# EAGLE design HopeToPass-BASIC (EAGLE 9.6.2)
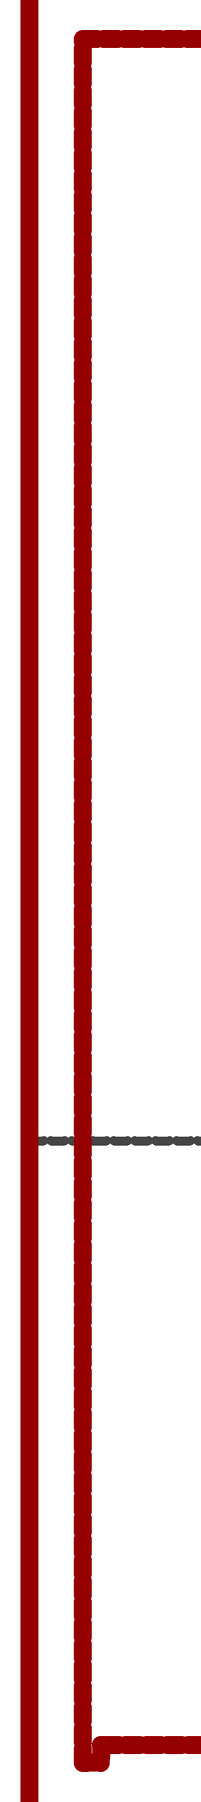
[diagram p0: schematic, sheet 1, part 1 of 2]
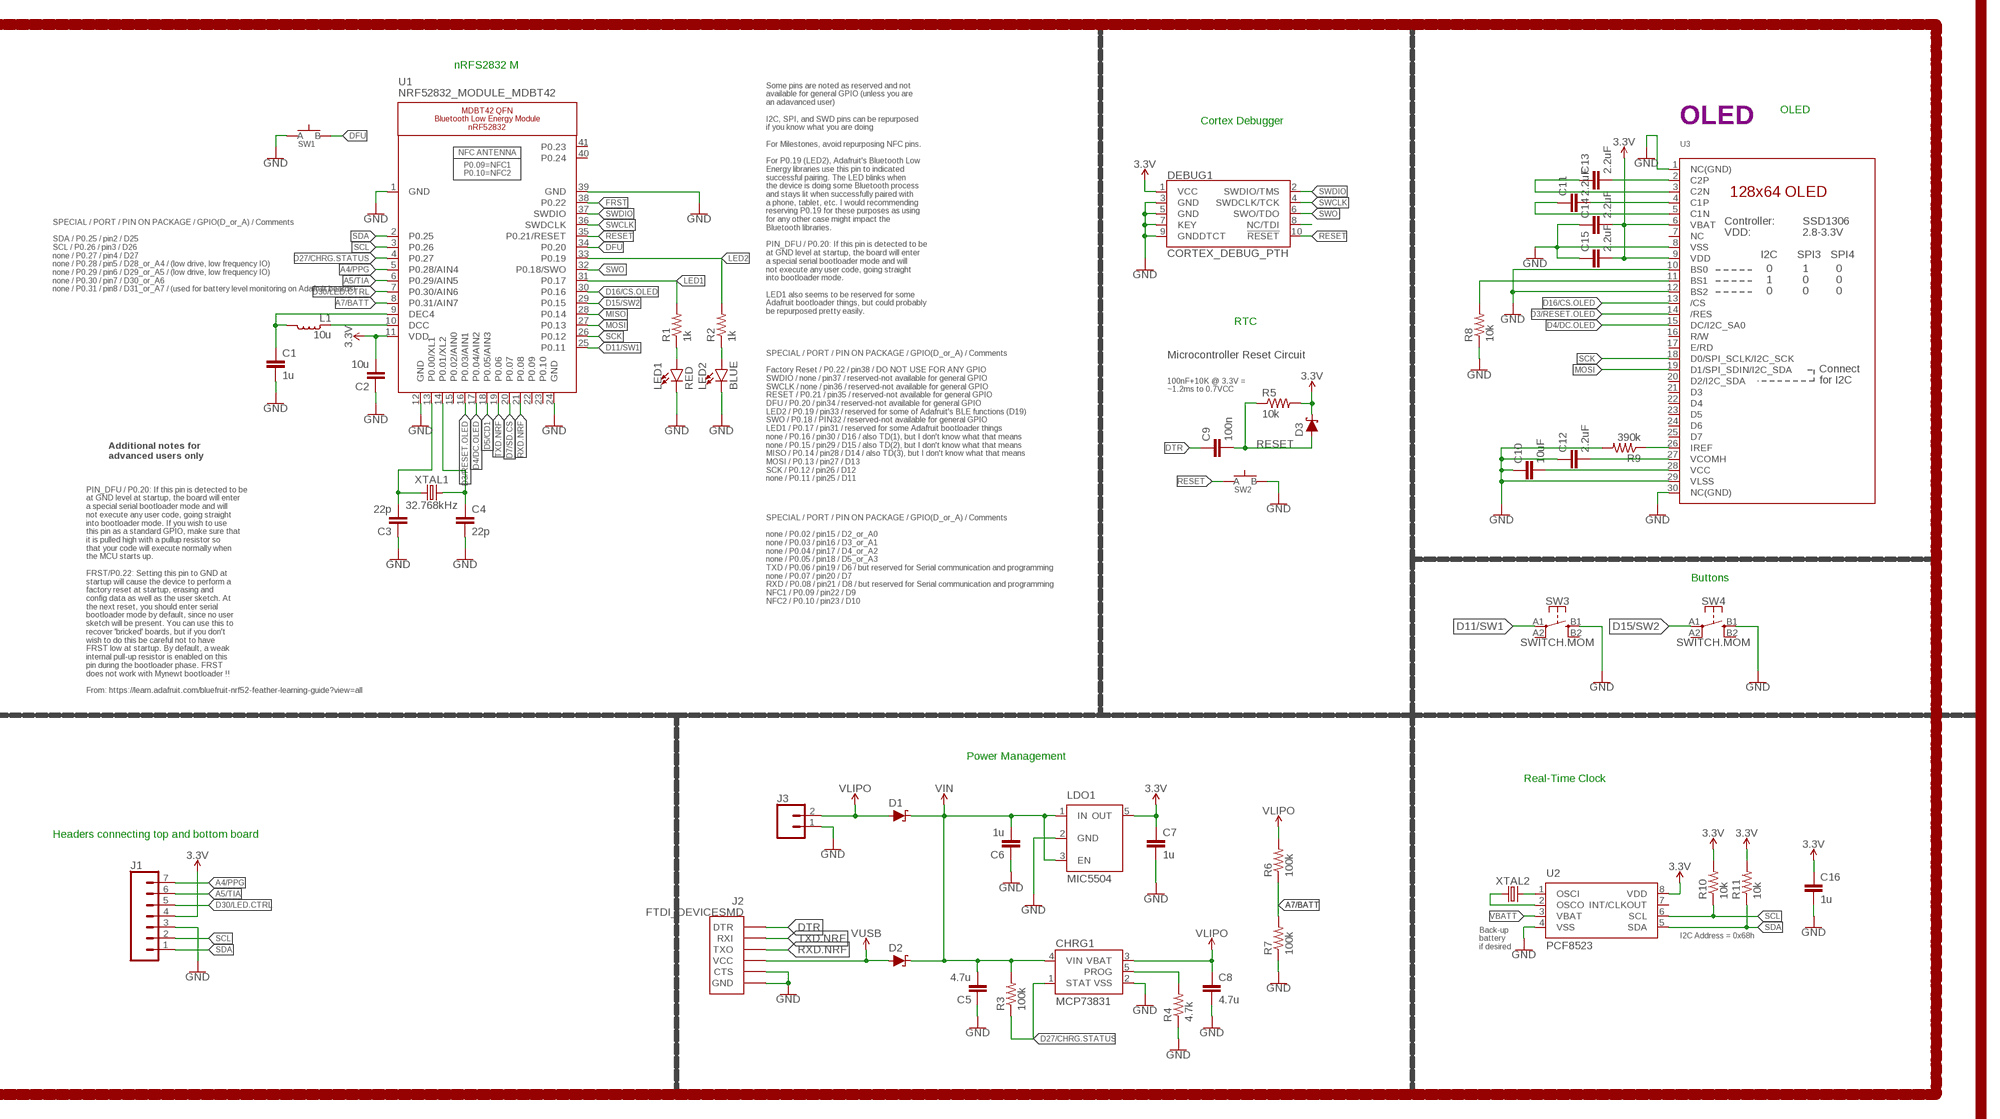
[diagram p1: schematic, sheet 1, part 2 of 2]

## Parts
C1  1u  CAPACITOR0603  [C0603]
C2  10u  CAPACITOR0805  [C0805]
C3  22p  CAPACITOR0603  [C0603]
C4  22p  CAPACITOR0603  [C0603]
C5  4.7u  CAPACITOR0603  [C0603]
C6  1u  CAPACITOR0603  [C0603]
C7  1u  CAPACITOR0603  [C0603]
C8  4.7u  CAPACITOR0603  [C0603]
C9  100n  CAPACITOR0603  [C0603]
C10  10uF  CAPACITOR0603  [C0603]
C11  2.2uF  CAPACITOR0603  [C0603]
C12  2.2uF  CAPACITOR0603  [C0603]
C13  2.2uF  CAPACITOR0603  [C0603]
C14  2.2uF  CAPACITOR0603  [C0603]
C15  2.2uF  CAPACITOR0603  [C0603]
C16  1u  CAPACITOR0603  [C0603]
CHRG1  MCP73831  [SOT23-5]
D1  SCHOTTKY-USC  [USC]
D2  SCHOTTKY-USC  [USC]
D3  SCHOTTKY-USC  [USC]
DEBUG1  CORTEX_DEBUG_PTH  [2X5-PTH-1.27MM]
J1  CONN_07-1.27MM  [1X07_1.27MM]
J2  FTDI_DEVICESMD  [FTDI-SMD]
J3  CONN_02  [1X02]
L1  10u  INDUCTOR0603  [L0603]
LDO1  MIC5504  [SOT23-5]
LED1  RED  LED0603  [LED-0603]
LED2  BLUE  LED0603  [LED-0603]
R1  1k  RESISTOR0603  [R0603]
R2  1k  RESISTOR0603  [R0603]
R3  100k  RESISTOR0603  [R0603]
R4  4.7k  RESISTOR0603  [R0603]
R5  10k  RESISTOR0603  [R0603]
R6  100k  RESISTOR0603  [R0603]
R7  100k  RESISTOR0603  [R0603]
R8  10k  RESISTOR0603  [R0603]
R9  390k  RESISTOR0603  [R0603]
R10  10k  RESISTOR0603  [R0603]
R11  10k  RESISTOR0603  [R0603]
SW1  SPST-PTS830GG140-COPY.1-3  [BUTTON-GULLWING]
SW2  SPST-PTS830GG140-COPY.1-3  [BUTTON-GULLWING]
SW3  SWITCH.MOM  [TACTILE_SWITCH_SMD_6.2MM_TALL]
SW4  SWITCH.MOM  [TACTILE_SWITCH_SMD_6.2MM_TALL]
U1  NRF52832_MODULE_MDBT42  [BLE_MODULE_RAYTAC_MDBT42]
U2  PCF8523  [SO8]
U3  DISP_OLED_UG-2864HSWEG01-NO-WRAPAROUND  [UG-2864HSWEG01_0.96IN_NO-WRAPAROUND]
XTAL1  32.768kHz  CRYSTALECS-.327-12.5-12-C-TR  [2-SMD.NOLEAD.2.0MMTO1.2MM]
XTAL2  32.7680kHz  CRYSTALECS-.327-12.5-12-C-TR  [2-SMD.NOLEAD.2.0MMTO1.2MM]

## Nets
3.3V: C2.2 C7.1 C14.2 C15.2 C16.1 D3.-(C) DEBUG1.1(VCC) J1.4 LDO1.5(OUT) R5.2 R10.2 R11.2 U1.11(VDD) U2.8(VDD) U3.6(VBAT) U3.9(VDD)
A4/PPG: J1.7 U1.5(P0.28/AIN4)
A5/TIA: J1.6 U1.6(P0.29/AIN5)
A7/BATT: R6.1 R7.2 U1.8(P0.31/AIN7)
D3/RESET.OLED: U1.16(P0.03/AIN1) U3.14(/RES)
D4/DC.OLED: U1.17(P0.04/AIN2) U3.15(DC/I2C_SA0)
D5/CD1: U1.18(P0.05/AIN3)
D7/SD.CS: U1.20(P0.07)
D11/SW1: SW3.A1 U1.25(P0.11)
D15/SW2: SW4.A1 U1.29(P0.15)
D16/CS.OLED: U1.30(P0.16) U3.13(/CS)
D27/CHRG.STATUS: CHRG1.1(STAT) R3.1 U1.4(P0.27)
D30/LED.CTRL: J1.5 U1.7(P0.30/AIN6)
DFU: SW1.3(B) U1.34(P0.20)
DTR: C9.1 J2.DTR
FRST: U1.38(P0.22)
GND: C1.2 C2.1 C3.1 C4.2 C5.1 C6.1 C7.2 C8.2 C10.1 C12.1 C14.1 C15.1 C16.2 CHRG1.2(VSS) DEBUG1.3(GND) DEBUG1.5(GND) DEBUG1.7(KEY) DEBUG1.9(GNDDTCT) J1.3 J2.CTS J2.GND J3.1 LDO1.2(GND) LED1.C LED2.C R4.1 R7.1 R8.1 R9.2 SW1.1(A) SW2.3(B) SW3.B1 SW4.B1 U1.1(GND) U1.12(GND) U1.24(GND) U1.39(GND) U2.4(VSS) U3.1(NC(GND)) U3.8(VSS) U3.10(BS0) U3.12(BS2) U3.29(VLSS) U3.30(NC(GND))
LED1: R1.2 U1.31(P0.17)
LED2: R2.2 U1.33(P0.19)
MISO: U1.28(P0.14)
MOSI: U1.27(P0.13) U3.19(D1/SPI_SDIN/I2C_SDA)
N$1: R8.2 U3.11(BS1)
N$2: R9.1 U3.26(IREF)
N$3: C13.2 U3.2(C2P)
N$4: C3.2 U1.13(P0.00/XL1) XTAL1.P$1
N$5: C13.1 U3.3(C2N)
N$6: C4.1 U1.14(P0.01/XL2) XTAL1.P$2
N$7: C11.2 U3.4(C1P)
N$8: C11.1 U3.5(C1N)
N$9: LED1.A R1.1
N$10: LED2.A R2.1
N$11: L1.1 U1.10(DCC)
N$12: C1.1 L1.2 U1.9(DEC4)
N$13: C10.2 U3.28(VCC)
N$14: DEBUG1.8(NC/TDI)
N$15: C12.2 U3.27(VCOMH)
N$17: CHRG1.5(PROG) R4.2
N$21: U2.2(OSCO) XTAL2.P$1
N$22: U2.1(OSCI) XTAL2.P$2
RESET: C9.2 D3.+(A) DEBUG1.10(!RESET) R5.1 SW2.1(A) U1.35(P0.21/RESET)
RXD.NRF: J2.TXO U1.21(P0.08)
SCK: U1.26(P0.12) U3.18(D0/SPI_SCLK/I2C_SCK)
SCL: J1.2 R10.1 U1.3(P0.26) U2.6(SCL)
SDA: J1.1 R11.1 U1.2(P0.25) U2.5(SDA)
SWCLK: DEBUG1.4(SWDCLK/TCK) U1.36(SWDCLK)
SWDIO: DEBUG1.2(SWDIO/TMS) U1.37(SWDIO)
SWO: DEBUG1.6(SWO/TDO) U1.32(P0.18/SWO)
TXD.NRF: J2.RXI U1.19(P0.06)
V_USB: D2.+(A) J2.VCC ; supply symbol labelled VUSB
VBATT: U2.3(VBAT)
VIN: C5.2 C6.2 CHRG1.4(VIN) D1.-(C) D2.-(C) LDO1.1(IN) LDO1.3(EN) R3.2
VLIPO: C8.1 CHRG1.3(VBAT) D1.+(A) J3.2 R6.2
Unconnected: SW3.A2 SW3.B2 SW4.A2 SW4.B2 U1.15(P0.02/AIN0) U1.22(P0.09) U1.23(P0.10) U1.40(P0.24) U1.41(P0.23) U2.7(INT/CLKOUT) U3.7(NC) U3.16(R/W) U3.17(E/RD) U3.20(D2/I2C_SDA) U3.21(D3) U3.22(D4) U3.23(D5) U3.24(D6) U3.25(D7)

## Notes on the sheet
- nRFS2832 M
- OLED
- Cortex Debugger | OLED
- SPECIAL / PORT / PIN ON PACKAGE / GPIO(D_or_A) / Comments
  
  SDA / P0.25 / pin2 / D25
  SCL / P0.26 / pin3 / D26
  none / P0.27 / pin4 / D27
  none / P0.28 / pin5 / D28_or_A4 / (low drive, low frequency IO)
  none / P0.29 / pin6 / D29_or_A5 / (low drive, low frequency IO)
  none / P0.30 / pin7 / D30_or_A6
  none / P0.31 / pin8 / D31_or_A7 / (used for battery level monitoring on Adafruit boards)
- Some pins are noted as reserved and not
  available for general GPIO (unless you are
  an adavanced user)
  
  I2C, SPI, and SWD pins can be repurposed
  if you know what you are doing
  
  For Milestones, avoid repurposing NFC pins.
  
  For P0.19 (LED2), Adafruit's Bluetooth Low
  Energy libraries use this pin to indicated
  successful pairing. The LED blinks when
  the device is doing some Bluetooth process
  and stays lit when successfully paired with
  a phone, tablet, etc. I would recommending
  reserving P0.19 for these purposes as using
  for any other case might impact the
  Bluetooth libraries.
  
  PIN_DFU / P0.20: If this pin is detected to be
  at GND level at startup, the board will enter
  a special serial bootloader mode and will
  not execute any user code, going straight
  into bootloader mode.
  
  LED1 also seems to be reserved for some
  Adafruit bootloader things, but could probably
  be repurposed pretty easily.
- RTC
- Microcontroller Reset Circuit
- 100nF+10K @ 3.3V =
  ~1.2ms to 0.7VCC
- Additional notes for
  advanced users only
- SPECIAL / PORT / PIN ON PACKAGE / GPIO(D_or_A) / Comments
  
  Factory Reset / P0.22 / pin38 / DO NOT USE FOR ANY GPIO
  SWDIO / none / pin37 / reserved-not available for general GPIO
  SWCLK / none / pin36 / reserved-not available for general GPIO
  RESET / P0.21 / pin35 / reserved-not available for general GPIO
  DFU / P0.20 / pin34 / reserved-not available for general GPIO
  LED2 / P0.19 / pin33 / reserved for some of Adafruit's BLE functions (D19)
  SWO / P0.18 / PIN32 / reserved-not available for general GPIO
  LED1 / P0.17 / pin31 / reserved for some Adafruit bootloader things
  none / P0.16 / pin30 / D16 / also TD(1), but I don't know what that means
  none / P0.15 / pin29 / D15 / also TD(2), but I don't know what that means
  MISO / P0.14 / pin28 / D14 / also TD(3), but I don't know what that means
  MOSI / P0.13 / pin27 / D13
  SCK / P0.12 / pin26 / D12
  none / P0.11 / pin25 / D11
- Buttons
- SPECIAL / PORT / PIN ON PACKAGE / GPIO(D_or_A) / Comments
  
  none / P0.02 / pin15 / D2_or_A0
  none / P0.03 / pin16 / D3_or_A1
  none / P0.04 / pin17 / D4_or_A2
  none / P0.05 / pin18 / D5_or_A3
  TXD / P0.06 / pin19 / D6 / but reserved for Serial communication and programming
  none / P0.07 / pin20 / D7
  RXD / P0.08 / pin21 / D8 / but reserved for Serial communication and programming
  NFC1 / P0.09 / pin22 / D9
  NFC2 / P0.10 / pin23 / D10
- PIN_DFU / P0.20: If this pin is detected to be
  at GND level at startup, the board will enter
  a special serial bootloader mode and will
  not execute any user code, going straight
  into bootloader mode. If you wish to use
  this pin as a standard GPIO, make sure that
  it is pulled high with a pullup resistor so
  that your code will execute normally when
  the MCU starts up.
  
  FRST/P0.22: Setting this pin to GND at
  startup will cause the device to perform a
  factory reset at startup, erasing and
  config data as well as the user sketch. At
  the next reset, you should enter serial
  bootloader mode by default, since no user
  sketch will be present. You can use this to
  recover 'bricked' boards, but if you don't
  wish to do this be careful not to have
  FRST low at startup. By default, a weak
  internal pull-up resistor is enabled on this
  pin during the bootloader phase. FRST
  does not work with Mynewt bootloader !!
  
  From: https://learn.adafruit.com/bluefruit-nrf52-feather-learning-guide?view=all
- Power Management
- Real-Time Clock
- Headers connecting top and bottom board
- I2C Address = 0x68h
- Back-up
  battery
  if desired

## Library data of the parts
C1-C16 = LinnesLab-Passives:CAPACITOR
CHRG1 = LinnesLab-Power:MCP73831: MCP73831T Li-Ion, Li-Pol Controller Miniature single cell, fully integrated Li-Ion, Li-polymer charge management controller Datasheet <http://ww1.microchip.com/downloads/en/DeviceDoc/20001984g.pdf> SparkFun Products: SparkFun ESP32 Thing <https://www.sparkfun.com/products/13907> SparkFun 9DoF Razor IMU M0 <https://www.sparkfun.com/products/14001>; PROD_ID: IC-09995
D1-D3 = LinnesLab-DiscreteSemi:SCHOTTKY: Schottky diode A Schottky diode is a semiconductor diode which has a low forward voltage drop and a very fast switching action. Example: Digi-Key Part Number: RB161MM-20CT-ND
DEBUG1 = LinnesLab-Connectors:CORTEX_DEBUG: Cortex Debug Connector - 10 pin Supports JTAG debug, Serial Wire debug, and Serial Wire Viewer. PTH and SMD connector options available. General Connector Information <http://infocenter.arm.com/help/topic/com.arm.doc.faqs/attached/13634/cortex_debug_connectors.pdf> Products: PTH Connector <http://www.digikey.com/product-detail/en/cnc-tech/3220-10-0100-00/1175-1627-ND/3883661> -via Digi-Key SparkFun PSoc <https://www.sparkfun.com/products/13229> SparkFun T <https://www.sparkfun.com/products/13810>
J1 = LinnesLab-Connectors:CONN_07: Multi connection point. Often used as Generic Header-pin footprint for 0.1 inch spaced/style header connections On any of the 0.1 inch spaced packages, you can populate with these: Break Away Headers - Straight <https://www.sparkfun.com/products/116> (PRT-00116) Break Away Male Headers - Right Angle <https://www.sparkfun.com/products/553> (PRT-00553) Female Headers <https://www.sparkfun.com/products/115> (PRT-00115) Break Away Headers - Machine Pin <https://www.sparkfun.com/products/117> (PRT-00117) Break Away Female Headers - Swiss Machine Pin <https://www.sparkfun.com/products/743> (PRT-00743) For SCREWTERMINALS and SPRING TERMINALS visit here: Screw Terimnals on SparkFun.com <https://www.sparkfun.com/search/results?term=Screw+Terminals> (5mm/3.5mm/2.54mm spacing) This device is also useful as a general connection point to wire up your design to another part of your project. Our various solder wires solder well into these plated through hole pads. Hook-Up Wire - Assortment (Stranded, 22 AWG) <https://www.sparkfun.com/products/11375> (PRT-11375) Hook-Up Wire - Assortment (Solid Core, 22 AWG) <https://www.sparkfun.com/products/11367> (PRT-11367) View the entire wire category on our website here <https://www.sparkfun.com/categories/141> Special notes: Molex polarized connector foot print use with SKU : PRT-08231 with associated crimp pins and housings. 1MM SMD Version SKU: PRT-10208 NOTES ON THE VARIANTS LOCK and LOCK_LONGPADS... This footprint was designed to help hold the alignment of a through-hole component (i.e. 6-pin header) while soldering it into place. You may notice that each hole has been shifted either up or down by 0.005 of an inch from it's more standard position (which is a perfectly straight line). This slight alteration caused the pins (the squares in the middle) to touch the edges of the holes. Because they are alternating, it causes a "brace" to hold the component in place. 0.005 has proven to be the perfect amount of "off-center" position when using our standard breakaway headers. Although looks a little odd when you look at the bare footprint, once you have a header in there, the alteration is very hard to notice. Also,if you push a header all the way into place, it is covered up entirely on the bottom side.
J2 = LinnesLab-Connectors:FTDI_DEVICE
J3 = LinnesLab-Connectors:CONN_02: Multi connection point. Often used as Generic Header-pin footprint for 0.1 inch spaced/style header connections On any of the 0.1 inch spaced packages, you can populate with these: Break Away Headers - Straight <https://www.sparkfun.com/products/116> (PRT-00116) Break Away Male Headers - Right Angle <https://www.sparkfun.com/products/553> (PRT-00553) Female Headers <https://www.sparkfun.com/products/115> (PRT-00115) Break Away Headers - Machine Pin <https://www.sparkfun.com/products/117> (PRT-00117) Break Away Female Headers - Swiss Machine Pin <https://www.sparkfun.com/products/743> (PRT-00743) For SCREWTERMINALS and SPRING TERMINALS visit here: Screw Terimnals on SparkFun.com <https://www.sparkfun.com/search/results?term=Screw+Terminals> (5mm/3.5mm/2.54mm spacing) This device is also useful as a general connection point to wire up your design to another part of your project. Our various solder wires solder well into these plated through hole pads. Hook-Up Wire - Assortment (Stranded, 22 AWG) <https://www.sparkfun.com/products/11375> (PRT-11375) Hook-Up Wire - Assortment (Solid Core, 22 AWG) <https://www.sparkfun.com/products/11367> (PRT-11367) View the entire wire category on our website here <https://www.sparkfun.com/categories/141> Special notes: Molex polarized connector foot print use with: PRT-08233 with associated crimp pins and housings. 2.54_SCREWTERM for use with PRT-10571. 3.5mm Screw Terminal footprints for PRT-08084 5mm Screw Terminal footprints for use with PRT-08432
L1 = LinnesLab-Passives:INDUCTOR
LDO1 = LinnesLab-Power:MIC5504: MIC5504 Voltage Regulator Output Voltages: 1.0V to 3.3V Input Voltages: 2.5V to 5.5V Link to Datasheet http://ww1.microchip.com/downloads/en/DeviceDoc/MIC550X.pdf
LED1 LED2 = LinnesLab-LED:LED: LED (Generic) Standard schematic elements and footprints for 5mm, 3mm, 1206, and 0603 sized LEDs. Generic LEDs with no color specified. LTST-C190KGKT: arrow indicates cathode
R1-R11 = LinnesLab-Passives:RESISTOR
SW1 SW2 = LinnesLab-Switches:SPST-PTS830GG140-COPY
SW3 SW4 = LinnesLab-Switches:SWITCH.MOM: PTS645SM43SMTR92 LFS
U1 = LinnesLab-Microcontrollers:NRF52832_MODULE_MDBT42: MDBT42 - BLE Module (nRF52832 QFN) VDD: 1.7-3.6V
U2 = LinnesLab-Clocks:PCF8523; DIGIKEY: 568-5306-1-ND; I2C_ADDRESS: 0x68h; MFN: PCF8523T/1,118; MFN_MANUFACTURER: NXP USA Inc.
U3 = LinnesLab-Displays:DISP_OLED_UG-2864HSWEG01: UG-2864HSWEG01 OLED display Both 1.3" and 0.96" models share the same FPC tab footprint, only the screen dimensions vary.
XTAL1 XTAL2 = LinnesLab-Clocks:CRYSTAL; DIGIKEY: XC2288CT-ND; FREQ: 32.7680KHZ; LOAD_CAP: 12.5pF

## Board
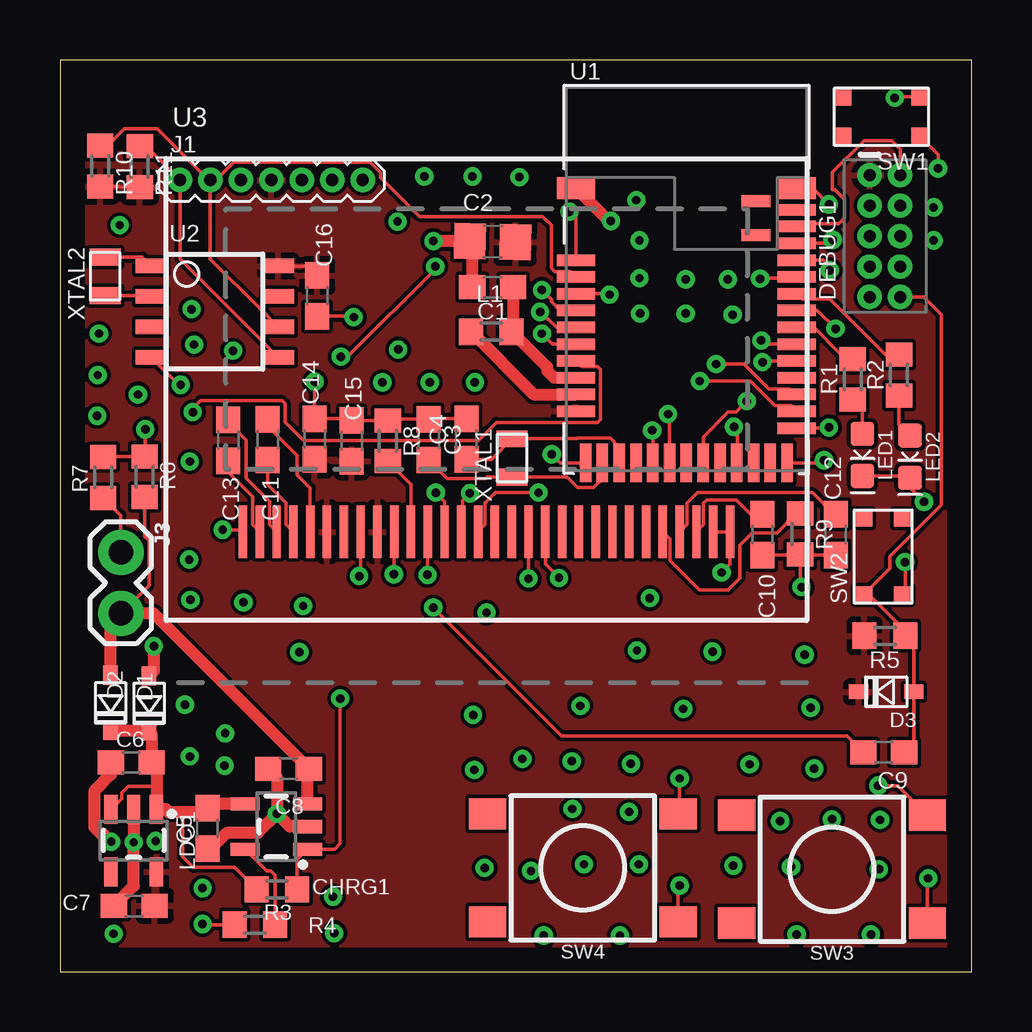
[diagram p2: board, top side]
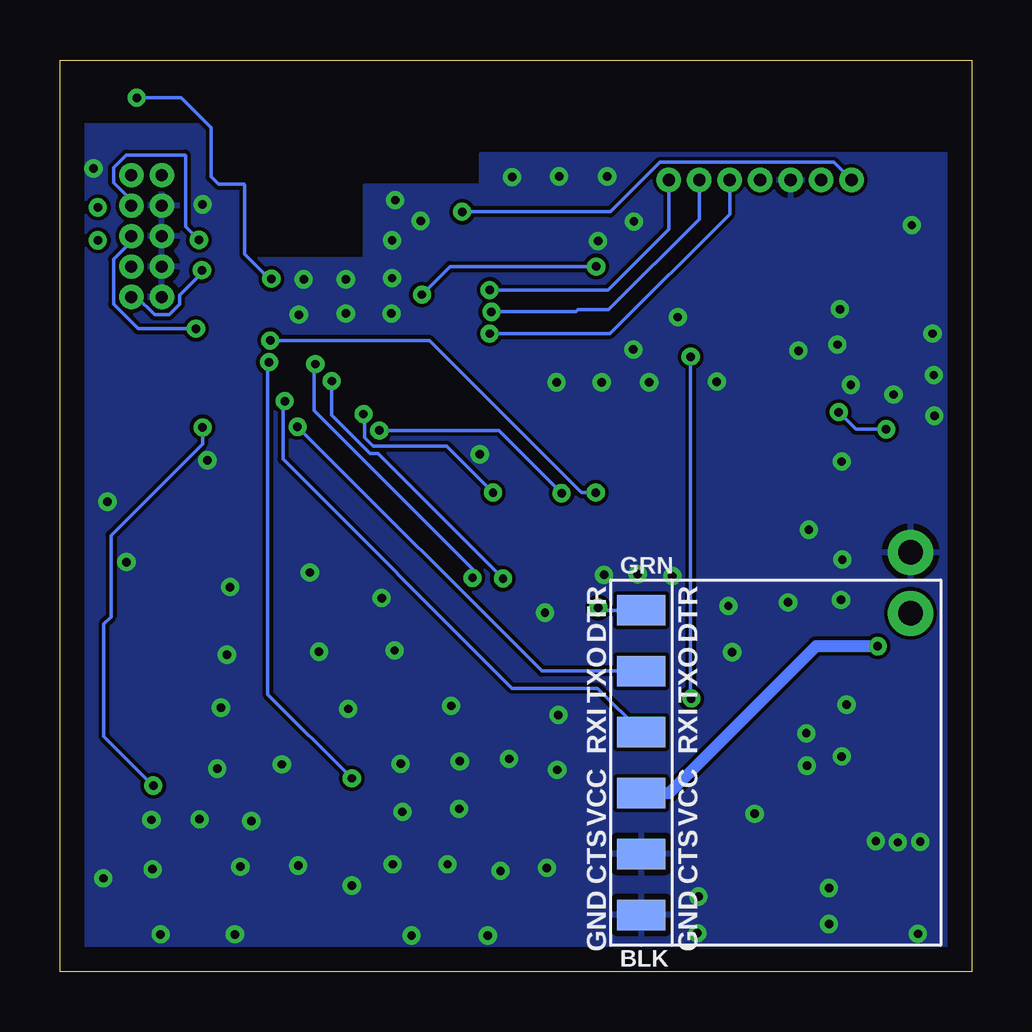
[diagram p3: board, bottom side, seen from below]

Size 38 x 38 mm. Coordinates in mm from the lower left corner, seen from the top.
Outline: 0,0 38,0 38,38 0,38 0,0
Copper layers (1*16): Top 0.035mm / dielectric 1.5mm / Bottom 0.035mm
Design rules "default": minimum track width 6mil, minimum drill 0.35mm, track to track 6mil, track to pad 6mil, pad to pad 6mil, via to via 6mil, smd to smd 6mil, copper to edge 40mil, drill to drill 6mil, minimum pad ring 10mil, minimum via ring 8mil, stop-mask expansion 4mil, vias tented up to drill 0mil, thermal gap 10mil

### Footprints (pad centres in the part's own frame; a part is rotated, then mirrored left to right if it is on the bottom)
C0603 = smd 1.1 x 1: 1 -0.85,0; 2 0.85,0
C0805 = smd 1.3 x 1.5: 1 -0.95,0; 2 0.95,0
SOT23-5 = smd 0.55 x 1.2: 1 -0.95,-1.3; 2 0,-1.3; 3 0.95,-1.3; 4 0.95,1.3; 5 -0.95,1.3
USC = smd 0.8 x 0.6: + -1.15,0; - 1.15,0
2X5-PTH-1.27MM = drill 0.508 pad 1: 1 -2.54,-0.635; 2 -2.54,0.635; 3 -1.27,-0.635; 4 -1.27,0.635; 5 0,-0.635; 6 0,0.635; 7 1.27,-0.635; 8 1.27,0.635; 9 2.54,-0.635; 10 2.54,0.635
1X07_1.27MM = drill 0.508 pad 1: 1 0,0; 2 1.27,0; 3 2.54,0; 4 3.81,0; 5 5.08,0; 6 6.35,0; 7 7.62,0
FTDI-SMD = smd 1.27 x 2.03: CTS 3.81,0; DTR -6.35,0; GND 6.35,0; RXI -1.27,0; TXO -3.81,0; VCC 1.27,0
1X02 = drill 1.016 pad 1.88: 1 0,0; 2 2.54,0
L0603 = smd 1 x 1.1: 1 -0.85,0; 2 0.85,0
LED-0603 = smd 1 x 1: A -0.877,0; C 0.877,0
R0603 = smd 1 x 1.1: 1 -0.85,0; 2 0.85,0
BUTTON-GULLWING = smd 0.7 x 0.75: 1 -1.6,0.825; 2 1.6,0.825; 3 -1.6,-0.825; 4 1.6,-0.825
TACTILE_SWITCH_SMD_6.2MM_TALL = smd 1.55 x 1.3: A1 -3.975,-2.25; A2 3.975,-2.25; B1 -3.975,2.25; B2 3.975,2.25
BLE_MODULE_RAYTAC_MDBT42 = smd 1.6 x 0.9: 1 -4.6,3.8; 39 4.6,3.8 | smd 1.6 x 0.48: 2 -4.6,0.8; 3 -4.6,0.1; 4 -4.6,-0.6; 5 -4.6,-1.3; 6 -4.6,-2; 7 -4.6,-2.7; 8 -4.6,-3.4; 9 -4.6,-4.1; 10 -4.6,-4.8; 11 -4.6,-5.5; 25 4.6,-6.2; 26 4.6,-5.5; 27 4.6,-4.8; 28 4.6,-4.1; 29 4.6,-3.4; 30 4.6,-2.7; 31 4.6,-2; 32 4.6,-1.3; 33 4.6,-0.6; 34 4.6,0.1; 35 4.6,0.8; 36 4.6,1.5; 37 4.6,2.2; 38 4.6,2.9 | smd 0.48 x 1.6: 12 -4.2,-7.65; 13 -3.5,-7.65; 14 -2.8,-7.65; 15 -2.1,-7.65; 16 -1.4,-7.65; 17 -0.7,-7.65; 18 0,-7.65; 19 0.7,-7.65; 20 1.4,-7.65; 21 2.1,-7.65; 22 2.8,-7.65; 23 3.5,-7.65; 24 4.2,-7.65 | smd 1.2 x 0.5: 40 2.9,3.25; 41 2.9,1.85
SO8 = smd 1.3 x 0.6: 1 -2.65,1.905; 2 -2.65,0.635; 3 -2.65,-0.635; 4 -2.65,-1.905; 5 2.65,-1.905; 6 2.65,-0.635; 7 2.65,0.635; 8 2.65,1.905
UG-2864HSWEG01_0.96IN_NO-WRAPAROUND = smd 0.35 x 2.2: 1 -10.15,-1.2; 2 -9.45,-1.2; 3 -8.75,-1.2; 4 -8.05,-1.2; 5 -7.35,-1.2; 6 -6.65,-1.2; 7 -5.95,-1.2; 8 -5.25,-1.2; 9 -4.55,-1.2; 10 -3.85,-1.2; 11 -3.15,-1.2; 12 -2.45,-1.2; 13 -1.75,-1.2; 14 -1.05,-1.2; 15 -0.35,-1.2; 16 0.35,-1.2; 17 1.05,-1.2; 18 1.75,-1.2; 19 2.45,-1.2; 20 3.15,-1.2; 21 3.85,-1.2; 22 4.55,-1.2; 23 5.25,-1.2; 24 5.95,-1.2; 25 6.65,-1.2; 26 7.35,-1.2; 27 8.05,-1.2; 28 8.75,-1.2; 29 9.45,-1.2; 30 10.15,-1.2
2-SMD.NOLEAD.2.0MMTO1.2MM = smd 0.7 x 1.3: P$1 -0.8,0; P$2 0.8,0

### Placement (x,y rotation side)
C1  18.03,28.52 180 top
C2  18.03,30.43 358.7 top
C3  15.37,22.17 270 top
C4  16.94,22.2 90 top
C5  6.15,5.97 90 top
C6  2.97,8.71 0 top
C7  3.1,2.74 180 top
C8  9.53,8.46 180 top
C9  34.34,9.14 0 top
C10  29.29,18.21 90 top
C11  8.66,22.17 270 top
C12  32.33,18.21 90 top
C13  7.01,22.15 270 top
C14  10.62,22.2 270 top
C15  12.17,22.12 270 top
C16  10.72,28.17 270 top
CHRG1  9.02,6.05 90 top
D1  2.11,11.2 270 top
D2  3.71,11.18 270 top
D3  34.44,11.66 180 top
DEBUG1  34.39,30.66 270 top
J1  5,33 0 top
J2  13.77,8.71 270 bottom
J3  2.54,17.48 270 top
L1  17.98,26.67 0 top
LDO1  3.07,5.46 180 top
LED1  33.45,21.54 270 top
LED2  35.43,21.46 270 top
R1  33.05,24.69 90 top
R2  34.98,24.87 90 top
R3  9.04,3.43 180 top
R4  8.13,1.96 0 top
R5  34.39,14 180 top
R6  3.53,20.62 270 top
R7  1.8,20.6 90 top
R8  13.67,22.12 270 top
R9  30.86,18.24 270 top
R10  1.68,33.58 270 top
R11  3.33,33.55 270 top
SW1  34.24,35.64 180 top
SW2  34.32,17.3 90 top
SW3  32.18,4.27 180 top
SW4  21.79,4.32 180 top
U1  26.11,28.85 0 top
U2  6.45,27.51 0 top
U3  17.78,19.53 0 top
XTAL1  18.85,21.41 90 top
XTAL2  1.88,28.98 90 top

### Tracks (layer width: path | path; a pad name or v marks a point on that pad's centre or on a via)
3.3V
  Top 0.152: R11.2 1.68,32.75 R10.2 | U2.8 10.32,29.41 C16.1
  pour Top: 0.56,34.14 20.47,34.14 20.47,32.84 25.32,32.84 25.32,29.74 30.15,29.74 30.15,32.84 31.78,32.84 31.78,32.97 31.78,35.31 37.77,35.31 37.77,0.41 0.56,0.41
A4/PPG  (via drill 0.35)
  Top 0.152: v20.09,28.41 20.48,28.02 20.48,27.92 20.85,27.55 U1.5
  Bottom 0.152: J1.7 12.62,30.94 15.15,28.41 v20.09,28.41
A5/TIA  (via drill 0.35)
  Top 0.152: U1.6 20.69,26.85 20.34,27.2 20.32,27.2 v20.02,27.5
  Bottom 0.152: v20.02,27.5 16.49,27.5 16.41,27.58 15.14,27.58 11.35,31.37 J1.6
A7/BATT  (via drill 0.35)
  Top 0.152: R7.2 1.83,21.48 R6.1 3.56,21.5 v3.56,22.61 | U1.8 21.74,25.22 22.41,25.22 22.54,25.09 22.54,23.02 22.41,22.89 18.2,22.89 17.45,22.14 10.16,22.14 9.39,22.9 9.39,23.67 9.26,23.8 5.86,23.8 5.54,23.48 v5.54,23.32
  Bottom 0.152: v5.54,23.32 4.83,22.61 v3.56,22.61
D3/RESET.OLED  (via drill 0.35)
  Top 0.152: U3.14 16.78,18.39 16.78,19.63 v17.09,19.94 | v24.69,22.55 24.71,22.53 U1.16
  Bottom 0.152: v17.09,19.94 19.7,22.55 v24.69,22.55
D4/DC.OLED  (via drill 0.35)
  Top 0.152: U1.17 25.41,23.18 v25.35,23.24 | U3.15 17.73,18.63 17.73,19.53 18.16,19.96 v19.95,19.96
  Bottom 0.152: v19.95,19.96 21.88,21.9 24.94,21.9 25.3,22.25 25.3,23.19 v25.35,23.24
D11/SW1  (via drill 0.35)
  Top 0.152: U1.25 32.03,22.65 v32.05,22.68 | SW3.A1 34.93,7.75 v34.11,7.75
  Bottom 0.152: v32.05,22.68 32.05,22 35.87,18.18 35.87,14.79 36.17,14.48 36.17,9.8 v34.11,7.75
D15/SW2  (via drill 0.35)
  Top 0.152: U1.29 29.34,25.45 v29.29,25.4 | v25.83,8.05 25.83,6.63 SW4.A1
  Bottom 0.152: v29.29,25.4 29.34,25.35 29.34,11.56 v25.83,8.05
D16/CS.OLED  (via drill 0.35)
  Top 0.152: U3.13 16.03,19.6 v15.67,19.96 | v29.23,26.31 29.39,26.15 U1.30
  Bottom 0.152: v15.67,19.96 16.25,19.96 22.6,26.31 v29.23,26.31
D27/CHRG.STATUS  (via drill 0.35)
  Top 0.152: R3.1 9.89,4.67 CHRG1.1 11.45,5.09 11.68,5.33 v11.68,11.38 | U1.4 22.88,28.25 v22.91,28.22 | v15.65,29.39 15.65,29.29 11.99,25.63 v11.71,25.63
  Bottom 0.152: v22.91,28.22 21.74,29.39 v15.65,29.39 | v11.71,25.63 11.71,11.4 v11.68,11.38
D30/LED.CTRL  (via drill 0.35)
  Top 0.152: U1.7 20.53,26.15 v20.09,26.59
  Bottom 0.152: v20.09,26.59 15.06,26.59 10.08,31.58 J1.5
DFU  (via drill 0.35)
  Top 0.152: SW1.3 34.84,36.46 v34.8,36.42 | v29.18,28.88 29.21,28.91 30.66,28.91 U1.34
  Bottom 0.152: v29.18,28.88 29.28,28.88 30.3,29.9 30.3,32.79 30.33,32.82 31.38,32.82 31.7,33.13 31.7,35.18 32.94,36.42 v34.8,36.42
DTR  (via drill 0.35)
  Top 0.152: C9.1 32.8,9.83 20.9,9.83 v15.56,15.17
  Bottom 0.152: v15.56,15.17 15.45,15.06 J2.DTR
GND  (via drill 0.35)
  Top 0.152: LED1.C 35.36,20.66 LED2.C 35.43,20.17 v36.02,19.58 | SW1.1 36.61,34.05 v36.61,33.48 | SW2.3 35.23,15.79 v35.23,17.07 | SW3.B1 36.16,3.85 v36.2,3.89 | SW4.B1 25.77,3.52 v25.83,3.58 | U3.1 7.55,18.41 v6.78,18.41 | U3.8 12.53,16.54 v12.47,16.48 | U3.10 13.93,16.57 v13.92,16.56 | U3.12 v15.33,16.55 v15.32,16.54 | v10.62,24.59 C14.1 12.09,23.05 C15.1 R8.1 13.72,23.02 C3.1 15.39,23.05 C4.2 | U1.12 20.86,21.2 v20.5,21.57 | R4.1 5.97,1.96 v5.94,1.98 | J3.1 2.54,19.01 R7.1 | C10.1 30.84,17.36 | 30.84,17.36 R9.2 30.86,16.08 v30.91,16.03 | U3.29 U3.30 27.93,16.98 v27.58,16.64 | C12.1 30.84,17.36 | U1.24 31.75,21.2 v31.85,21.31 | U1.39 31.38,32.65 v32.05,31.98 | U2.4 4.95,24.46 v5.03,24.46 | C16.2 12.2,27.32 v12.24,27.28
  Top 0.508: 2.12,8.62 C6.1 2.12,8.21 1.44,7.53 1.44,5.99 1.68,5.75 1.79,5.75 v2.13,5.41 | LDO1.2 v3.07,5.38 3.07,3.57 C7.2 | CHRG1.2 9.58,6.04 v9.04,6.58 | v9.04,6.58 8.24,5.78 6.95,5.78 6.29,5.12 C5.1 | C8.2 9.04,8.09 v9.04,6.58 | U1.1 22.87,31.29 v22.96,31.29 | C1.2 17.18,30.35 C2.1 v15.57,30.45
  other vias: 2.24,1.57 3.99,5.44 31.45,8.46 33.81,1.55 30.71,1.55 23.8,8.66 23.34,1.5 20.17,1.5 19.28,8.86 11.43,1.6 11.38,3.12 5.94,3.48 5.41,8.97 6.88,9.93 5.21,11.13 5.38,17.17 5.41,21.26 15.42,24.56 14.07,31.27 17.7,4.32 19.63,4.19 21.84,4.47 34.14,4.27 30.48,4.37 1.57,24.87 1.63,26.59 17.22,10.69 24.05,13.39 27.2,13.34 31.04,13.21 6.86,8.59 19.15,33.12 17.2,33.15 15.19,33.15 7.21,25.88 5.59,26.14 5.49,27.61 14.1,25.93 10.13,15.24 5.44,15.49 2.49,31.11 24.16,30.48 24.03,32.16 24.18,27.43 26.09,27.43 27.84,28.85 28.04,27.38 24.59,15.57 25.98,10.95 21.36,6.78 28.07,4.42 13.44,24.56 1.55,23.16 3.25,24.05 24.16,28.91 26.09,28.85 31.29,11 21.69,11.07 17.27,8.41 21.34,8.76 23.72,6.65 24.13,4.47 28.75,8.64 30.02,6.27 32.18,6.35 34.19,6.32 7.65,15.39 9.98,13.31 17.3,24.56 17.78,14.96
  pour Bottom: 0.48,34.09 20.47,34.09 20.47,32.79 25.3,32.79 25.3,29.72 30.28,29.72 30.28,32.77 31.8,32.77 31.8,35.31 37.67,35.31 37.67,0.43 0.43,0.43
LED1
  Top 0.152: U1.31 31.42,26.85 32.49,25.78 32.8,25.78 R1.2
LED2
  Top 0.152: R2.2 34.41,25.72 32.1,28.03 30.94,28.03 U1.33
MOSI  (via drill 0.35)
  Top 0.152: U3.19 20.23,16.98 v20.8,16.41 | U1.27 30.68,24.03 30.43,24.29 29.54,24.29 28.5,25.32 v27.36,25.32
  Bottom 0.152: v20.8,16.41 20.8,16.79 27.41,23.39 27.41,25.27 v27.36,25.32
N$1
  Top 0.152: R8.2 14.63,20.31 U3.11
N$2
  Top 0.152: R9.1 30.68,19.09 29.88,18.28 28.83,18.28 28.33,17.78 28.33,16.4 27.84,15.91 26.65,15.91 25.43,17.14 25.43,18.04 U3.26
N$3
  Top 0.152: U3.2 8.03,18.63 8.03,19.79 7.01,20.82 C13.2
N$4
  Top 0.152: C3.2 16.15,20.55 17.74,20.55 17.81,20.61 XTAL1.P$1 21.14,20.61 21.58,20.18 22.25,20.18 22.61,20.54 U1.13
N$5
  Top 0.152: U3.3 8.73,18.63 8.73,19.6 7.76,20.57 7.76,22.15 7.01,22.9 C13.1
N$6
  Top 0.152: C4.1 17.98,21.35 XTAL1.P$2 21.56,22.21 21.58,22.23 22.95,22.23 23.31,21.87 U1.14
N$7
  Top 0.152: U3.4 9.43,18.63 9.43,19.53 8.66,20.3 C11.2
N$8
  Top 0.152: U3.5 10.43,20.16 9.89,20.7 9.89,21.52 8.66,22.75 C11.1
N$9
  Top 0.152: R1.1 33.45,23.43 LED1.A
N$10
  Top 0.152: LED2.A 34.98,22.8 R2.1
N$11
  Top 0.508: L1.1 19.75,24.05 U1.10
N$12
  Top 0.508: C1.1 18.88,26.72 L1.2 20.3,25.2 20.3,25.05 20.6,24.75 U1.9
N$13
  Top 0.152: U3.28 26.83,18.63 26.83,19.53 26.96,19.66 28.2,19.66 28.8,19.06 C10.2
N$15
  Top 0.152: U3.27 26.13,18.63 26.13,19.53 26.57,19.97 31.36,19.97 32.26,19.06 C12.2
N$17
  Top 0.152: CHRG1.5 8.6,4.21 8.79,4.21 8.98,4.02 R4.2
N$21
  Top 0.152: XTAL2.P$1 3.76,28.18 U2.2
N$22
  Top 0.152: XTAL2.P$2 3.43,29.78 U2.1
N$25  (via drill 0.35)
  other vias: 36.42,31.85
N$26  (via drill 0.35)
  other vias: 36.42,30.48
RESET  (via drill 0.35)
  Top 0.152: U1.35 31.81,29.65 32.08,29.39 v32.08,29.23 | C9.2 35.59,9.55 D3.+ 35.59,13.64 R5.1 35.24,14.2 33.69,15.76 33.56,15.63 SW2.1 34.6,16.8 34.6,17.3 36.74,19.44 36.74,27.38 36.01,28.12 DEBUG1.10
  Bottom 0.152: DEBUG1.10 34.8,28.12 34.06,27.38 33.45,27.38 33.02,27.81 33.02,28.19 32.08,29.13 v32.08,29.23
RXD.NRF  (via drill 0.35)
  Top 0.152: U1.21 28.25,21.24 28.25,22.56 v28.1,22.71
  Bottom 0.152: v28.1,22.71 17.91,12.52 J2.TXO
SCK  (via drill 0.35)
  Top 0.152: U3.18 v19.53,16.38 | v26.67,24.61 28.78,24.61 29.81,23.59 30.48,23.59 U1.26
  Bottom 0.152: v19.53,16.38 24.74,21.59 25.07,21.59 26.67,23.2 v26.67,24.61
SCL
  Top 0.152: U2.6 8.36,27.61 6.27,29.7 6.27,32.92 | 6.27,32.92 J1.2 6.5,33 7.24,33.74 12.93,33.74 13.36,33.3 13.36,33.1 14.99,31.47 20.12,31.47 20.48,31.11 20.48,29.32 20.62,29.19 21.28,29.19 U1.3 | R10.1 1.98,34.43 2.68,35.13 4.06,35.13 6.27,32.92
SDA  (via drill 0.35)
  Top 0.152: U2.5 8.36,26.34 5,29.7 J1.1 3.6,34.4 R11.1 | v21.23,31.67 21.51,31.4 U1.2
  Bottom 0.152: v21.23,31.67 15.06,31.67 13,33.74 5.74,33.74 J1.1
SWCLK  (via drill 0.35)
  Top 0.152: U1.36 32.06,30.35 v32.21,30.5
  Bottom 0.152: v32.21,30.5 32.77,31.06 32.77,34.01 32.79,34.04 35.23,34.04 35.76,33.5 35.76,32.89 35.03,32.16 DEBUG1.4
SWDIO
  Top 0.152: U1.37 30.84,31.18 32.47,31.18 32.69,31.41 32.69,32.2 32.31,32.59 32.21,32.59 32.21,33.33 33.53,34.65 34.67,34.65 35.03,34.29 DEBUG1.2
SWO  (via drill 0.35)
  Top 0.152: U1.32 31.58,27.55 v32.33,26.8
  Bottom 0.152: DEBUG1.6 35.03,30.43 35.76,29.69 35.76,27.81 34.75,26.8 v32.33,26.8
TXD.NRF  (via drill 0.35)
  Top 0.152: U1.19 26.82,21.22 26.82,22.29 27.85,23.31 28.17,23.31 v28.63,23.77
  Bottom 0.152: J2.RXI 15.6,11.81 19.15,11.81 28.7,21.36 28.7,23.7 v28.63,23.77
V_USB  (via drill 0.35)
  Top 0.508: v3.91,13.56 3.91,12.53 D2.+
  Bottom 0.508: J2.VCC 12.6,7.44 6.48,13.56 v3.91,13.56
VIN
  Top 0.152: LDO1.3 2.57,7.21 2.57,7.46 2.84,7.72 4.02,7.72 | 5.11,6.63 5.11,4.79 5.55,4.34 7.28,4.34 R3.2
  Top 0.508: D1.- 2.13,10.03 D2.- 3.82,9.91 C6.2 4.02,8.51 4.02,7.72 LDO1.1 4.42,6.76 4.55,6.63 5.11,6.63 5.96,6.63 C5.2 6.32,7 CHRG1.4
VLIPO
  Top 0.152: R6.2 3.53,18.14 3.71,17.96 3.71,16.1 J3.2
  Top 0.508: D1.+ 2.11,14.5 J3.2 3.9,14.94 C8.1 10.32,8.4 CHRG1.3